# EAGLE design nixie_clock (EAGLE 9.5.1)
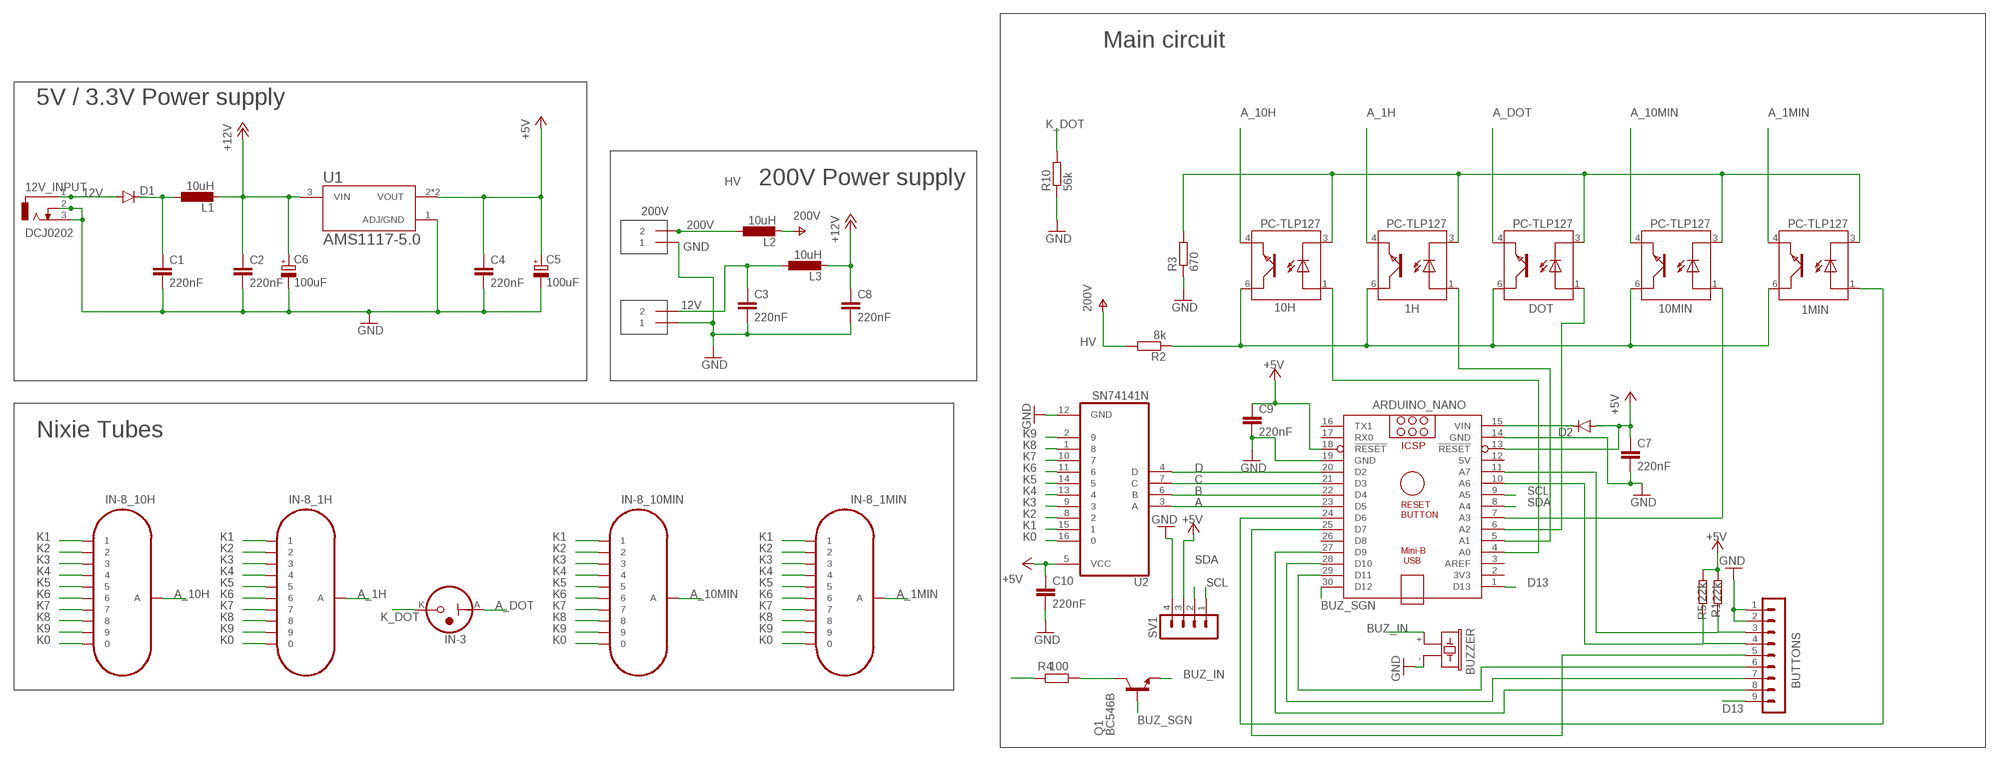
[diagram p0: schematic, sheet 1]

## Parts
1H  PC-TLP127  [MINIFLAT4]
1MIN  PC-TLP127  [MINIFLAT4]
10H  PC-TLP127  [MINIFLAT4]
10MIN  PC-TLP127  [MINIFLAT4]
12V  TERMINAL_2P  [KF301-2P]
12V_INPUT  DCJ0202  [DCJ0202]
200V  TERMINAL_2P  [KF301-2P]
ARDUINO_NANO  ARDUINO_NANO  [ARDUINO_NANO]
BUTTONS  MA09-1  [MA09-1]
BUZZER  F/CM12P  [F/CM12P]
C1  220nF  C2,5-3  [C2.5-3]
C2  220nF  C2,5-3  [C2.5-3]
C3  220nF  C2,5-3  [C2.5-3]
C4  220nF  C2,5-3  [C2.5-3]
C5  100uF  CPOL-EUE2,5-6E  [E2,5-6E]
C6  100uF  CPOL-EUE2,5-6E  [E2,5-6E]
C7  220nF  C2,5-3  [C2.5-3]
C8  220nF  C2,5-3  [C2.5-3]
C9  220nF  C2,5-3  [C2.5-3]
C10  220nF  C2,5-3  [C2.5-3]
D1  1N4148DO35-7  [DO35-7]
D2  1N4148DO35-7  [DO35-7]
DOT  PC-TLP127  [MINIFLAT4]
IN-3  IN-3  [IN-3]
IN-8_1H  IN-8  [IN-8]
IN-8_1MIN  IN-8  [IN-8]
IN-8_10H  IN-8  [IN-8]
IN-8_10MIN  IN-8  [IN-8]
L1  10uH  L-EU0204/7  [0204/7]
L2  10uH  L-EU0204/7  [0204/7]
L3  10uH  L-EU0204/7  [0204/7]
Q1  BC546B  [TO92-EBC]
R1  22k  R-EU_0204/7  [0204/7]
R2  8k  R-EU_0204/7  [0204/7]
R3  670  R-EU_0204/7  [0204/7]
R4  100  R-EU_0204/7  [0204/7]
R5  22k  R-EU_0204/7  [0204/7]
R10  56k  R-EU_0204/7  [0204/7]
SV1  MA04-1  [MA04-1]
U1  AMS1117-5.0  [SOT229P700X180-4N]
U2  SN74141N  [DIP762W46P254L2134H508Q16]

## Nets
12V [vastag]: 12V.2 12V_INPUT.1 C3.1 D1.A L3.1
200V [vastag]: 200V.2 L2.1
+5V [vastag]: ARDUINO_NANO.13(!RESET) ARDUINO_NANO.18(!RESET) C4.1 C5.+ C7.1 C9.1 C10.1 D2.A R1.2 R5.2 SV1.3 U1.2(VOUT) U1.4(VOUT) U2.5(VCC)
+12V [vastag]: C2.1 C6.+ C8.1 L1.2 L3.2 R4.1 U1.3(VIN)
A: ARDUINO_NANO.23(D5) U2.3(A)
A_1H [vastag]: 1H.4(TE) IN-8_1H.A
A_1MIN [vastag]: 1MIN.4(TE) IN-8_1MIN.A
A_10H [vastag]: 10H.4(TE) IN-8_10H.A
A_10MIN [vastag]: 10MIN.4(TE) IN-8_10MIN.A
A_DOT [vastag]: DOT.4(TE) IN-3.A
B: ARDUINO_NANO.22(D4) U2.6(B)
BUZ_IN: BUZZER.+ Q1.E
BUZ_SGN: ARDUINO_NANO.30(D12) Q1.B
C: ARDUINO_NANO.21(D3) U2.7(C)
D: ARDUINO_NANO.20(D2) U2.4(D)
D13: ARDUINO_NANO.1(D13) BUTTONS.9
GND [vastag]: 12V.1 12V_INPUT.2 12V_INPUT.3 200V.1 ARDUINO_NANO.14(GND) ARDUINO_NANO.19(GND) BUTTONS.1 BUTTONS.2 BUZZER.- C1.2 C2.2 C3.2 C4.2 C5.- C6.- C7.2 C8.2 C9.2 C10.2 R3.1 R10.1 SV1.4 U1.1(ADJ/GND) U2.12(GND)
HV [vastag]: L2.2 R2.2 ; supply symbol labelled 200V
K0 [vastag]: IN-8_1H.0 IN-8_1MIN.0 IN-8_10H.0 IN-8_10MIN.0 U2.16
K1 [vastag]: IN-8_1H.1 IN-8_1MIN.1 IN-8_10H.1 IN-8_10MIN.1 U2.15
K2 [vastag]: IN-8_1H.2 IN-8_1MIN.2 IN-8_10H.2 IN-8_10MIN.2 U2.8
K3 [vastag]: IN-8_1H.3 IN-8_1MIN.3 IN-8_10H.3 IN-8_10MIN.3 U2.9
K4 [vastag]: IN-8_1H.4 IN-8_1MIN.4 IN-8_10H.4 IN-8_10MIN.4 U2.13
K5 [vastag]: IN-8_1H.5 IN-8_1MIN.5 IN-8_10H.5 IN-8_10MIN.5 U2.14
K6 [vastag]: IN-8_1H.6 IN-8_1MIN.6 IN-8_10H.6 IN-8_10MIN.6 U2.11
K7 [vastag]: IN-8_1H.7 IN-8_1MIN.7 IN-8_10H.7 IN-8_10MIN.7 U2.10
K8 [vastag]: IN-8_1H.8 IN-8_1MIN.8 IN-8_10H.8 IN-8_10MIN.8 U2.1
K9 [vastag]: IN-8_1H.9 IN-8_1MIN.9 IN-8_10H.9 IN-8_10MIN.9 U2.2
K_DOT [vastag]: IN-3.K R10.2
N$1 [vastag]: ARDUINO_NANO.15(VIN) D2.C
N$2: C1.1 D1.C L1.1
N$3: 1MIN.1(A) ARDUINO_NANO.24(D6)
N$4: ARDUINO_NANO.25(D7) BUTTONS.5
N$5: 1H.6(TC) 1MIN.6(TC) 10H.6(TC) 10MIN.6(TC) DOT.6(TC) R2.1
N$7: Q1.C R4.2
N$9: ARDUINO_NANO.10(A6) BUTTONS.4 R5.1
N$10: ARDUINO_NANO.11(A7) BUTTONS.3 R1.1
N$15: 10H.1(A) ARDUINO_NANO.4(A0)
N$16: 1H.3(C) 1MIN.3(C) 10H.3(C) 10MIN.3(C) DOT.3(C) R3.2
N$18: ARDUINO_NANO.29(D11) BUTTONS.6
N$19: ARDUINO_NANO.28(D10) BUTTONS.7
N$20: ARDUINO_NANO.27(D9) BUTTONS.8
N$26: 1H.1(A) ARDUINO_NANO.5(A1)
N$27: ARDUINO_NANO.6(A2) DOT.1(A)
N$28: 10MIN.1(A) ARDUINO_NANO.7(A3)
SCL: ARDUINO_NANO.9(A5) SV1.1
SDA: ARDUINO_NANO.8(A4) SV1.2
Unconnected: ARDUINO_NANO.2(3V3) ARDUINO_NANO.3(AREF) ARDUINO_NANO.16(TX1) ARDUINO_NANO.17(RX0) ARDUINO_NANO.26(D8)

## Notes on the sheet
- Main circuit
- 5V / 3.3V Power supply
- 200V Power supply
- Nixie Tubes

## Power pins joined to a net without a drawn wire
5V: ARDUINO_NANO.12(5V)

## Library data of the parts
1H 1MIN 10H 10MIN DOT = we-opto:PC: Photocoupler / Photointerrupter TLP127 compatible with TLP187 and LTV-352T; DIGIKEY: TLP127FDKR-ND
12V 200V = KF301-2P-Terminal:TERMINAL_2P: Terminal Screw 2 Port 5mm Pitch
12V_INPUT = con-jack:DCJ0202: DC POWER JACK Source: DCJ0202.pdf; OC_FARNELL: unknown; OC_NEWARK: unknown
ARDUINO_NANO = arduinoNanoV30:ARDUINO_NANO: Arduino Nano V3.0 Overview: The Arduino Nano is a small, complete, and breadboard-friendly board based on the ATmega328 (Arduino Nano 3.x) or ATmega168 (Arduino Nano 2.x). It has more or less the same functionality of the Arduino Duemilanove, but in a different package. It lacks only a DC power jack, and works with a Mini-B USB cable instead of a standard one. The Nano was designed and is being produced by Gravitech. Specifications: Microcontroller Atmel ATmega168 or ATmega328 Operating Voltage (logic level) 5 V Input Voltage (recommended) 7-12 V Input Voltage (limits) 6-20 V Digital I/O Pins 14 (of which 6 provide PWM output) Analog Input Pins 8 DC Current per I/O Pin 40 mA Flash Memory 16 KB (ATmega168) or 32 KB (ATmega328) of which 2 KB used by bootloader SRAM 1 KB (ATmega168) or 2 KB (ATmega328) EEPROM 512 bytes (ATmega168) or 1 KB (ATmega328) Clock Speed 16 MHz Dimensions 0.73" x 1.70" Length 45 mm Width 18 mm Weigth 5 g Power: The Arduino Nano can be powered via the Mini-B USB connection, 6-20V unregulated external power supply (pin 30), or 5V regulated external power supply (pin 27). The power source is automatically selected to the highest voltage source. Memory: The ATmega168 has 16 KB of flash memory for storing code (of which 2 KB is used for the bootloader); the ATmega328 has 32 KB, (also with 2 KB used for the bootloader). The ATmega168 has 1 KB of SRAM and 512 bytes of EEPROM (which can be read and written with the EEPROM library); the ATmega328 has 2 KB of SRAM and 1 KB of EEPROM. Input and Output: Each of the 14 digital pins on the Nano can be used as an input or output, using pinMode(), digitalWrite(), and digitalRead() functions. They operate at 5 volts. Each pin can provide or receive a maximum of 40 mA and has an internal pull-up resistor (disconnected by default) of 20-50 kOhms. In addition, some pins have specialized functions. Visit Arduino - ArduinoBoardNano <https://www.arduino.cc/en/Main/ArduinoBoardNano>
BUTTONS = con-lstb:MA09-1: PIN HEADER; OC_FARNELL: unknown; OC_NEWARK: unknown
BUZZER = buzzer:F/CM12P: BUZZER Source: Buerklin; OC_FARNELL: unknown; OC_NEWARK: unknown
C1-C4 C7-C10 = capacitor-wima:C: CAPACITOR naming: grid - package width
C5 C6 = rcl:CPOL-EU: POLARIZED CAPACITOR, European symbol; SPICEPREFIX: C
D1 D2 = diode:1N4148: DIODE high speed (Philips)
IN-3 = nixies:IN-3: IN-3: nixie bulb
IN-8_1H IN-8_1MIN IN-8_10H IN-8_10MIN = nixies:IN-8: IN-8: medium numeric frontview nixie tube
L1-L3 = rcl:L-EU: INDUCTOR, European symbol; SPICEPREFIX: L
Q1 = transistor-npn:BC546*: NPN Transistor
R1-R5 R10 = rcl:R-EU_: RESISTOR, European symbol; SPICEPREFIX: R
SV1 = con-lstb:MA04-1: PIN HEADER; OC_FARNELL: unknown; OC_NEWARK: unknown
U1 = AMS1117-5.0:AMS1117-5.0: Sot223/Pkg 1-Amp 5-Volt Low Drop Out Voltage Regulatator; AVAILABILITY: Unavailable; DESCRIPTION: Sot223/Pkg 1-Amp 5-Volt Low Drop Out Voltage Regulatator; MF: Advanced Monolithic Systems; MP: AMS1117-5.0; PACKAGE: None; PRICE: None
U2 = SN74141N:SN74141N: BCD to DECIMAL Decoder/Driver; AVAILABILITY: Unavailable; MF: Texas Instruments; MP: SN74141N; PACKAGE: None; PRICE: None

## Net classes
0 default: width 0.152 mm, drill 0.2 mm, clearance 0.205 mm
1 vastag: width 0.254 mm, drill 0.2 mm, clearance 0.3 mm to class 0, clearance 0.3 mm

## Board
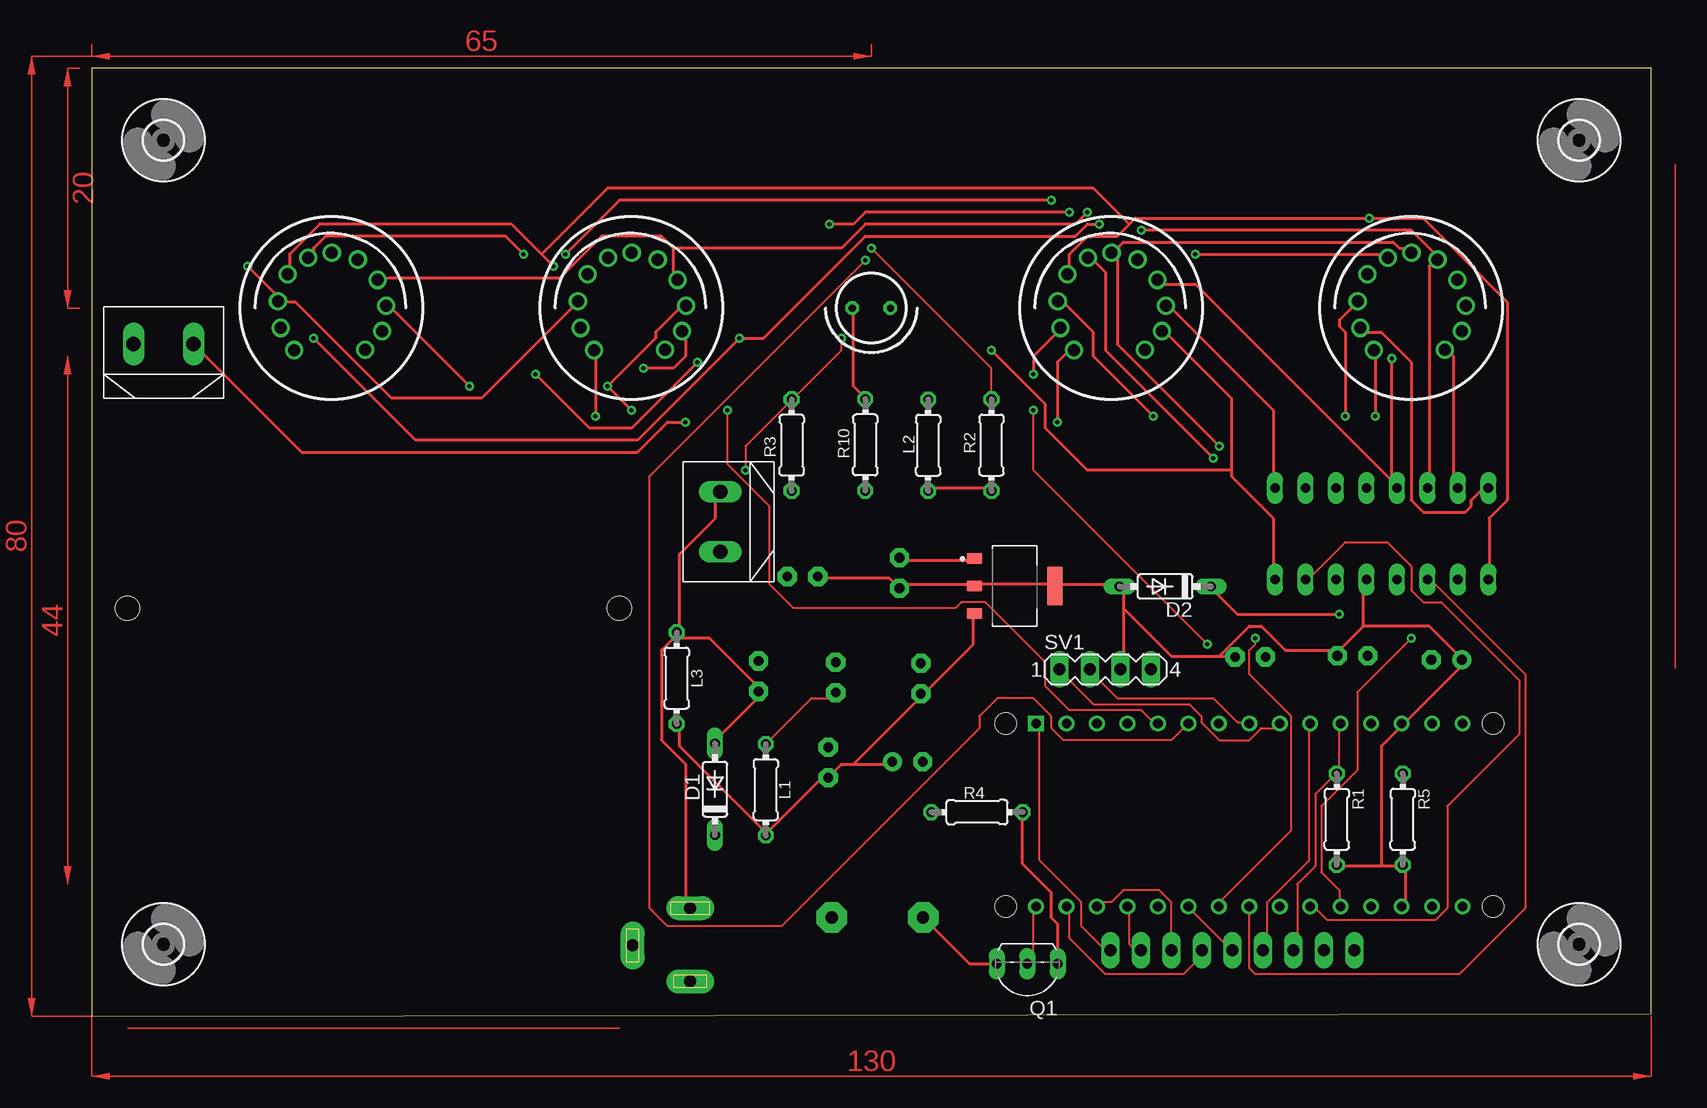
[diagram p1: board, top side]
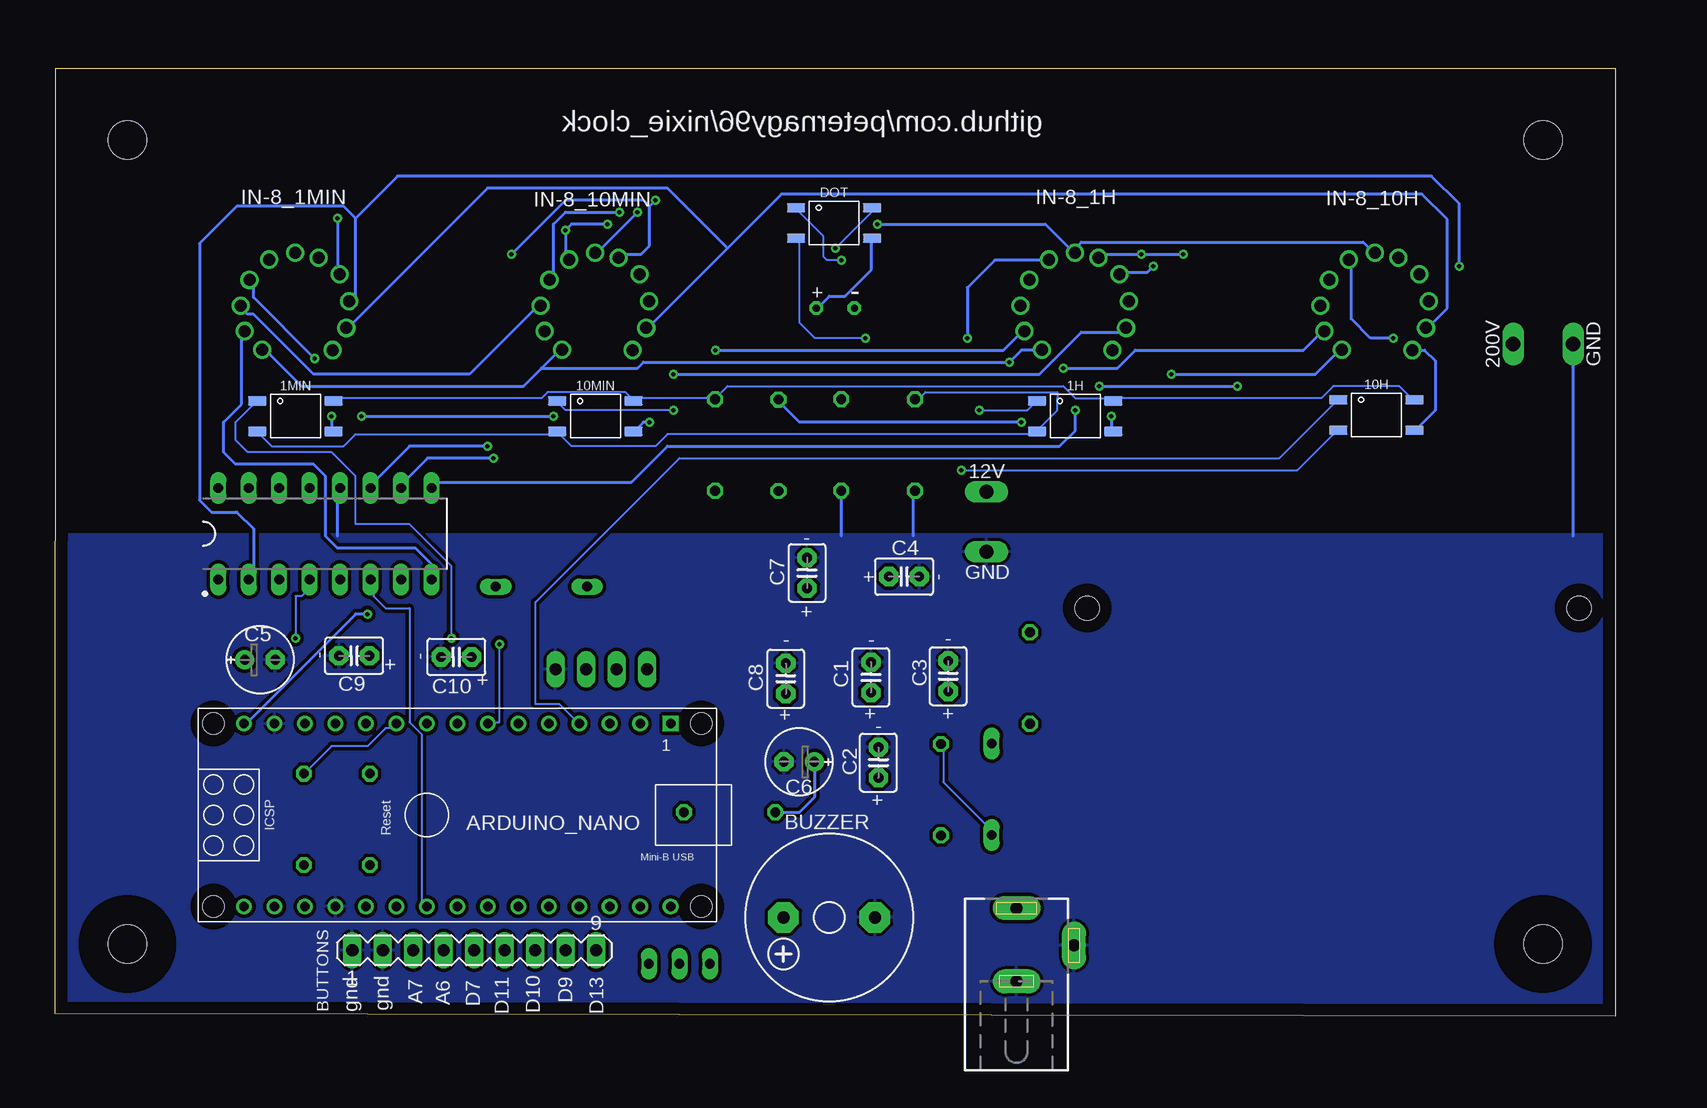
[diagram p2: board, bottom side, seen from below]

Size 130.03 x 79 mm. Coordinates in mm from the lower left corner, seen from the top.
Outline: 0,0 130.03,0.2 130,79 0,79 0,0
Copper layers (1*16): Top 0.035mm / dielectric 1.5mm / Bottom 0.035mm
Design rules "default": minimum track width 6mil, minimum drill 0.35mm, track to track 6mil, track to pad 6mil, pad to pad 6mil, via to via 6mil, smd to smd 6mil, copper to edge 40mil, drill to drill 6mil, minimum pad ring 10mil, minimum via ring 8mil, stop-mask expansion 4mil, vias tented up to drill 0mil, thermal gap 10mil
Holes 2 mm at 3,34 44,34

### Footprints (pad centres in the part's own frame; a part is rotated, then mirrored left to right if it is on the bottom)
MINIFLAT4 = smd 1.524 x 0.762: 1 -3.175,1.27; 3 -3.175,-1.27; 4 3.175,-1.27; 6 3.175,1.27
KF301-2P = drill 1.2 pad 1.778 long: 1 -2.5,0; 2 2.5,0
DCJ0202 = drill 1 pad 2 long: 1 0,3.1; 2 4.8,0; 3 0,-3
ARDUINO_NANO = drill 0.8 square: 1 -20.32,-7.62 | drill 0.8: 2 -17.78,-7.62; 3 -15.24,-7.62; 4 -12.7,-7.62; 5 -10.16,-7.62; 6 -7.62,-7.62; 7 -5.08,-7.62; 8 -2.54,-7.62; 9 0,-7.62; 10 2.54,-7.62; 11 5.08,-7.62; 12 7.62,-7.62; 13 10.16,-7.62; 14 12.7,-7.62; 15 15.24,-7.62; 16 15.24,7.62; 17 12.7,7.62; 18 10.16,7.62; 19 7.62,7.62; 20 5.08,7.62; 21 2.54,7.62; 22 0,7.62; 23 -2.54,7.62; 24 -5.08,7.62; 25 -7.62,7.62; 26 -10.16,7.62; 27 -12.7,7.62; 28 -15.24,7.62; 29 -17.78,7.62; 30 -20.32,7.62 | hole 1.778: -22.86,-7.62; -22.86,7.62; 17.78,7.62; 17.78,-7.62
MA09-1 = drill 1.016 long: 1 -10.16,0; 2 -7.62,0; 3 -5.08,0; 4 -2.54,0; 5 0,0; 6 2.54,0; 7 5.08,0; 8 7.62,0; 9 10.16,0
F/CM12P = drill 1.016 pad 2.54 octagon: + 3.81,0; - -3.81,0
C2.5-3 = drill 0.813 pad 1.6 octagon: 1 -1.27,0; 2 1.27,0
E2,5-6E = drill 0.813 pad 1.575: + -1.27,0 | drill 0.813 pad 1.575 octagon: - 1.27,0
DO35-7 = drill 0.813 long: A 3.81,0; C -3.81,0
IN-3 = drill 0.6 octagon: A -1.587,0; K 1.587,0
IN-8 = drill 1: 0 -4.244,-1.655; 1 2.792,-3.483; 2 4.222,-1.907; 3 4.556,0.189; 4 3.837,2.348; 5 2.203,4.052; 6 0.034,4.603; 7 -1.928,4.186; 8 -3.666,2.83; 9 -4.461,0.584; A -3.101,-3.49
0204/7 = drill 0.813 octagon: 1 -3.81,0; 2 3.81,0
TO92-EBC = drill 0.813 long: B 0,-1.27; C -2.54,-1.27; E 2.54,-1.27
MA04-1 = drill 1.016 long: 1 -3.81,0; 2 -1.27,0; 3 1.27,0; 4 3.81,0
SOT229P700X180-4N = smd 0.93 x 1.31: 1 -2.29,-3.345; 2 0,-3.345; 3 2.29,-3.345 | smd 3.24 x 1.31: 4 0,3.345
DIP762W46P254L2134H508Q16 = drill 0.813 long: 1 -3.81,8.89; 2 -3.81,6.35; 3 -3.81,3.81; 4 -3.81,1.27; 5 -3.81,-1.27; 6 -3.81,-3.81; 7 -3.81,-6.35; 8 -3.81,-8.89; 9 3.81,-8.89; 10 3.81,-6.35; 11 3.81,-3.81; 12 3.81,-1.27; 13 3.81,1.27; 14 3.81,3.81; 15 3.81,6.35; 16 3.81,8.89
3,2 = hole 3.2: 0,0

### Placement (x,y rotation side)
1H  45,50 0 bottom
1MIN  110,50 0 bottom
10H  19.9,50.1 0 bottom
10MIN  85,50 0 bottom
12V  52.4,41.2 90 top
12V_INPUT  49.9,5.9 0 bottom
200V  6,56 0 top
ARDUINO_NANO  99.05,16.76 180 bottom
BUTTONS  95.1,5.49 0 bottom
BUZZER  65.51,8.22 180 bottom
C1  62.03,28.23 90 bottom
C2  61.41,21.13 90 bottom
C3  55.59,28.33 90 bottom
C4  59.27,36.63 0 bottom
C5  112.95,29.69 0 bottom
C6  68.02,21.19 180 bottom
C7  67.35,36.93 90 bottom
C8  69.13,28.13 90 bottom
C9  105.11,30.03 180 bottom
C10  96.59,29.93 180 bottom
D1  51.97,18.91 90 top
D2  89.5,35.8 180 top
DOT  65.1,66.1 0 bottom
IN-3  65,59 180 top
IN-8_1H  45,59 0 top
IN-8_1MIN  110,59 0 top
IN-8_10H  20,59 0 top
IN-8_10MIN  85,59 0 top
L1  56.2,18.87 270 top
L2  69.74,47.57 270 top
L3  48.78,28.17 270 top
Q1  78,3.1 180 top
R1  103.8,16.4 270 top
R2  75.02,47.59 270 top
R3  58.36,47.59 90 top
R4  73.81,17 0 top
R5  109.3,16.4 270 top
R10  64.5,47.6 90 top
SV1  84.5,28.9 0 top
U1  76.96,35.83 270 top
U2  107.55,40.2 90 bottom
U$1  [3,2]  6,73 0 top
U$2  [3,2]  124,73 0 top
U$3  [3,2]  124,6 0 top
U$4  [3,2]  6,6 0 top

### Tracks (layer width: path | path; a pad name or v marks a point on that pad's centre or on a via)
12V
  Top 0.254: D1.A 52,23 56,27 C3.1 55.5,27.5 51.5,31.5 49,31.5 L3.1 | 12V.2 52,43.5 52,41.5 49,38.5 49,32 L3.1 | 12V_INPUT.1 49.5,9 49.5,21 47.5,23 47.5,30.5 48.5,31.5 L3.1
200V  (via drill 0.35)
  Top 0.254: v49.5,49.5 48,49.5 45.5,47 17.5,47 200V.2
  Bottom 0.254: v49.5,49.5 68,49.5 69.5,51 L2.1
+5V
  Top 0.254: 106,32.5 106,36 U2.5 | 106,32.5 104,30.5 C9.1 103.5,30.5 99.5,30.5 97.5,32.5 96.5,32.5 94,30 | ARDUINO_NANO.18 109.5,9.5 109.5,12.5 R5.2 109,12.5 107.5,12.5 | 107.5,12.5 104,12.5 R1.2 | 107.5,12.5 107.5,22.5 109,24 ARDUINO_NANO.13 109.5,24.5 114.5,29.5 C5.+ 114,30 111.5,32.5 106,32.5 | C4.1 61,36.5 66.5,36.5 67,36 C7.1 67.5,36 73.5,36 U1.2 74,36 80,36 U1.4 80.5,36 85.5,36 D2.A 86,35.5 86,34 | 86,34 86,29 SV1.3 | 94,30 90,30 86,34 | 94,30 95,30 C10.1
+12V
  Top 0.254: U1.3 73.5,33.5 73.5,31 69.5,27 C8.1 69,26.5 63.5,21 | L3.2 49,24 49,22.5 56,15.5 L1.2 56.5,15.5 61,20 C2.1 61.5,20 62.5,21 63.5,21 | 63.5,21 66.5,21 C6.+
  Bottom 0.254: R4.1 68,17 66.7,18.3 66.7,21.14 C6.+
A
  Top 0.152: ARDUINO_NANO.23 96.5,9 96.5,4 97,3.5 114,3.5 119.5,9 119.5,28.5 111.5,36.5 U2.3
A_1H  (via drill 0.35)
  Top 0.254: v42,50 42,55.5 IN-8_1H.A
  Bottom 0.254: v42,50 42,49 1H.4
A_1MIN  (via drill 0.35)
  Top 0.254: v107,50 107,55.5 IN-8_1MIN.A
  Bottom 0.254: v107,50 107,49 1MIN.4
A_10H
  Bottom 0.254: 10H.4 16.5,49 15,50.5 15,54.6 15.9,55.5 16.5,55.5 IN-8_10H.A
A_10MIN  (via drill 0.35)
  Top 0.254: v80.5,49.5 80.5,54.5 81.5,55.5 IN-8_10MIN.A
  Bottom 0.254: v80.5,49.5 81,49.5 81.5,49 10MIN.4
A_DOT
  Bottom 0.254: DOT.4 62,64.5 62,62.2 64.2,60 65.5,60 66.5,59 IN-3.A
B
  Bottom 0.152: ARDUINO_NANO.22 99.5,9.5 99.5,23.5 100.5,24.5 100.5,34 102.5,34 103.5,35 103.5,36 U2.6
BUZ_IN
  Top 0.254: BUZZER.+ 73.17,4.37 Q1.E
BUZ_SGN
  Top 0.152: ARDUINO_NANO.30 78.5,9 78.5,5 78,4.5 Q1.B
C
  Top 0.152: ARDUINO_NANO.21 102,9 103,8 112,8 113,9 113,17.5 119,23.5 119,28 112.5,34.5 111,34.5 110,35.5 110,37.5 108,39.5 104.5,39.5 101.5,36.5 U2.7
D  (via drill 0.35)
  Top 0.152: v110,31.5 105.5,27 105.5,20.5 102.5,17.5 102.5,12 104,10.5 104,9.5 ARDUINO_NANO.20
  Bottom 0.152: v110,31.5 110,35 109.5,35 108.5,36 U2.4
D13
  Top 0.152: ARDUINO_NANO.1 79,24 79,13 82.5,9.5 82.5,7.5 84.5,5.5 BUTTONS.9
GND
  Top 0.254: U1.1 73.5,38 67.5,38 C7.2
  Bottom 0.254: 58.5,40 58.5,43.5 R3.1 | 64.5,40 R10.1 | 106.5,40 106.5,44 U2.12 | 3.5,40 200V.1
  pour Bottom: -4,-8 131,-8 131,40.2 -4,40.2
HV
  Top 0.254: L2.2 70,44 75,44 R2.2
K0  (via drill 0.35)
  Top 0.254: U2.16 116,44 115,43 115,42.5 114.5,42 111,42 110,43 110,54.5 107.5,57 106,57 IN-8_1MIN.0 | v78.5,53.5 78.5,55 80.5,57 IN-8_10MIN.0
  Bottom 0.254: 74,64 80.5,57.5 IN-8_10MIN.0 | 74,64 69.5,68.5 16.1,68.5 14,66.4 14,59 15.5,57.5 IN-8_10H.0 | v78.5,53.5 48,53.5 44.5,57 41,57 IN-8_1H.0 | 74,64 79,69 94,69 105.5,57.5 IN-8_1MIN.0
K1  (via drill 0.35)
  Top 0.254: v37,53.5 41.5,49 45,49 v50.5,54.5 | U2.15 113.5,44.5 113.5,55 113,55.5 IN-8_1MIN.1
  Bottom 0.254: v37,53.5 25,53.5 23,55.5 IN-8_10H.1 | IN-8_1H.1 48,55.5 49.5,55.5 v50.5,54.5 81,54.5 81.5,54 89.5,54 | 89.5,54 91,52.5 109.5,52.5 112.5,55.5 IN-8_1MIN.1 | 89.5,54 88,55.5 IN-8_10MIN.1
K2  (via drill 0.35)
  Top 0.254: v46,54 48.5,54 49.5,55 49.5,57 IN-8_1H.2 | 95,45.5 95,51.5 89.5,57 IN-8_10MIN.2 | 95,45.5 95,45 98.5,41.5 98.5,36.5 U2.8 | v75,55.5 79.5,51 79.5,49 83,45.5 95,45.5
  Bottom 0.254: v46,54 41.5,54 40,55.5 26,55.5 24.5,57 IN-8_10H.2 | IN-8_1MIN.2 114.5,57 114.5,51 116,49.5 116,47 115,46 108.5,46 107.5,45 107.5,40 106.5,39 100,39 98.5,37.5 98.5,36.5 U2.8 | v75,55.5 51,55.5 49.5,57 IN-8_1H.2
K3  (via drill 0.35)
  Top 0.254: v31.5,52.5 25,59 IN-8_10H.3 | IN-8_1H.3 49.5,59.5 47,57 47,56.5 v43,52.5 v45,50.5 | U2.9 98.5,44.5 98.5,50.5 90,59 IN-8_10MIN.3
  Bottom 0.254: v43,52.5 v31.5,52.5 | IN-8_1MIN.3 114.5,59 114,58.5 113.5,58.5 108.5,53.5 95.5,53.5 90,59 IN-8_10MIN.3 | v45,50.5 45,48.8 46.3,47.5 79,47.5 82,44.5 98.5,44.5 U2.9
K4  (via drill 0.35)
  Top 0.254: 48.5,64 47.5,65 42.5,65 39,61.5 24,61.5 IN-8_10H.4 | 48.5,64 48.5,61.5 IN-8_1H.4 | 108.4,44.6 92,61 89,61 IN-8_10MIN.4 | 108.4,44.6 108.5,44.5 U2.13 | 108.4,44.6 v108.4,54.8 | 48.5,64 62.5,64 64.5,66 82,66 v83,67
  Bottom 0.254: v108.4,54.8 113.5,59.9 113.5,61 IN-8_1MIN.4 | v83,67 87.5,67 88.5,66 88.5,61.5 IN-8_10MIN.4
K5  (via drill 0.35)
  Top 0.254: U2.14 111.5,44.5 111.5,62.5 112,63 IN-8_1MIN.5 112,63.5 110,65.5 v87.5,65.5 | v18.5,56.5 27,48 45.5,48 v54,56.5 56,56.5 64.5,65 82,65 83,66 v84,66
  Bottom 0.254: IN-8_10MIN.5 87.5,63.5 v87.5,65.5 87,66 v84,66 | v18.5,56.5 20.4,56.5 22,58.1 22,63 IN-8_10H.5 | v54,56.5 54,60.7 51.7,63 47.5,63 IN-8_1H.5
K6  (via drill 0.35)
  Top 0.254: v94,47.5 85.5,56 85.5,63.5 IN-8_10MIN.6 85.5,64 86,64.5 108.5,64.5 109,64 110,64 IN-8_1MIN.6 | v61.5,66 63.5,66 64.5,67 v81.5,67
  Bottom 0.254: IN-8_10H.6 20.5,64 21,64.5 44.5,64.5 45,64 IN-8_1H.6 45.5,64 47.5,66 v61.5,66 | v94,47.5 100.5,47.5 103.5,44.5 U2.11 | v81.5,67 84.5,64 85,64 IN-8_10MIN.6
K7  (via drill 0.35)
  Top 0.254: v36,63.5 34.5,65 19.5,65 18.5,64 18.5,63.5 IN-8_10H.7 | v93.5,46.5 84.5,55.5 84.5,62 83.5,63 IN-8_10MIN.7 | v92,63.5 108,63.5 IN-8_1MIN.7 | v39.5,63.5 44,68 v80,68
  Bottom 0.254: v36,63.5 v39.5,63.5 43,63.5 IN-8_1H.7 | v93.5,46.5 99,46.5 101,44.5 U2.10 | v92,63.5 87.5,68 81,68 80.5,67.5 | 80.5,67.5 80.5,64.2 81.2,63.5 83,63.5 IN-8_10MIN.7 | 80.5,67.5 v80,68
K8  (via drill 0.35)
  Top 0.254: v38.5,62.5 37.5,63.5 | 37.5,63.5 35,66 19,66 16.5,63.5 16.5,62 IN-8_10H.8 | 86.5,66 85.5,65 83,65 81.5,63.5 81.5,62 IN-8_10MIN.8 | 86.5,66 87,66.5 v106.5,66.5 111,66.5 118,59.5 118,43 116.5,41.5 116.5,36.5 U2.1 | 37.5,63.5 43,69 83.5,69 86.5,66
  Bottom 0.254: v38.5,62.5 39,62 41,62 IN-8_1H.8 | v106.5,66.5 106.5,62 IN-8_1MIN.8
K9  (via drill 0.35)
  Top 0.254: IN-8_1H.9 40.5,59.5 32.5,51.5 25,51.5 17,59.5 16,59.5 IN-8_10H.9 15.5,60 v13,62.5 | v88.5,50 83.5,55 83.5,57 81,59.5 IN-8_10MIN.9 | v104.5,50 104.5,57 104,57.5 104,58 105.5,59.5 IN-8_1MIN.9
  Bottom 0.254: 105,66.5 106,67.5 114.9,67.5 118,64.4 118,43 117,42 115,42 114.9,42 113.5,40.6 113.5,36.5 U2.2 | 105,66.5 105,60 105.5,60 IN-8_1MIN.9 | v104.5,50 v88.5,50 | v13,62.5 13,67.7 15.3,70 101.5,70 105,66.5
K_DOT
  Top 0.254: IN-3.K 63.5,59 63.5,52.5 64.5,51.5 R10.2
N$1  (via drill 0.35)
  Top 0.254: v104,33.5 95.5,33.5 93.5,35.5 D2.C
  Bottom 0.254: v104,33.5 105,33.5 114,24.5 ARDUINO_NANO.15
N$2
  Top 0.152: C1.1 62,26.5 60,26.5 56.5,23 L1.1
  Bottom 0.152: D1.C 52,15.5 56,19.5 56,22.5 L1.1
N$3  (via drill 0.35)
  Top 0.152: v97,31.5 97,31 96.5,30.5 96.5,28.5 100,25 100,15.5 94,9.5 ARDUINO_NANO.24
  Bottom 0.152: v97,31.5 97,37.5 100.5,41 105,41 105,45 107,47 114,47 115,48 115,49.5 113.5,51 1MIN.1
N$4
  Top 0.152: ARDUINO_NANO.25 91.5,9 95,5.5 BUTTONS.5
N$5  (via drill 0.35)
  Top 0.152: v65,64 75,54 75,51.5 R2.1
  Bottom 0.152: 10H.6 17,51.5 18,52.5 23.5,52.5 24.5,51.5 41.5,51.5 1H.6 42,51.5 45,51.5 46,52.5 74,52.5 75,51.5 R2.1 75.5,51.5 81.5,51.5 10MIN.6 82,51.5 82.5,52 89,52 89.5,51.5 106.5,51.5 1MIN.6 | v65,64 62,67 DOT.6
N$7
  Top 0.254: Q1.C 80.54,7.66 80,8.2 80,10.3 77.6,12.7 77.6,16.98 R4.2
N$9
  Top 0.152: ARDUINO_NANO.10 101.5,24 101.5,13 98,9.5 98,5.5 BUTTONS.4
  Bottom 0.152: R5.1 109,20.5 107,22.5 104,22.5 102.5,24 102,24 ARDUINO_NANO.10
N$10
  Top 0.152: ARDUINO_NANO.11 104,24 104,20.5 R1.1 103.5,20 102,18.5 102,12.5 100.5,11 100.5,5.5 BUTTONS.3
N$15
  Bottom 0.152: 10H.1 23.5,51 28,46.5 78,46.5 90,34.5 90,26 88,26 86.5,24.5 ARDUINO_NANO.4
N$16  (via drill 0.35)
  Top 0.152: v54.5,45.5 54.5,47.5 58,51 R3.2 58.5,51.5 62.5,55.5 v62.5,56.5
  Bottom 0.152: 1MIN.3 113,48.5 112,47.5 106,47.5 105,48.5 88.5,48.5 10MIN.3 88,48.5 87,47.5 80,47.5 79,48.5 48.5,48.5 1H.3 48,49 46.5,50.5 46.5,51.3 46.5,51.5 | 46.5,51.5 46.5,52 57.5,52 58,51.5 R3.2 | v54.5,45.5 26.5,45.5 23.5,48.5 10H.3 | v62.5,56.5 66.7,56.5 68,57.8 68,64.5 DOT.3 | 46.5,51.5
N$18
  Top 0.152: ARDUINO_NANO.29 81.5,9 81.5,6.5 84.5,3.5 91,3.5 92.5,5 BUTTONS.6
N$19
  Top 0.152: ARDUINO_NANO.28 84,9.5 85,9.5 86,10.5 89,10.5 90,9.5 90,5.5 BUTTONS.7
N$20
  Top 0.152: ARDUINO_NANO.27 86.5,9 86.5,6 87,5.5 BUTTONS.8
N$26  (via drill 0.35)
  Top 0.152: v53,50.5 53,46 56.5,42.5 56.5,36 58.5,34 72,34 72.5,34.5 74.5,34.5 79.5,29.5 79.5,27.5 81.5,25.5 87.5,25.5 88.5,24.5 ARDUINO_NANO.5
  Bottom 0.152: v53,50.5 49,50.5 48.5,51 1H.1
N$27  (via drill 0.35)
  Top 0.152: v64.5,63 46.5,45 46.5,9 48,7.5 57.5,7.5 74,24 74,25 75.5,26.5 78.5,26.5 80,25 80,24 81,23 90,23 91,24 ARDUINO_NANO.6
  Bottom 0.152: v64.5,63 65.5,63 65.7,63 66,63.3 66,65 68,67 DOT.1
N$28  (via drill 0.35)
  Top 0.152: v78.5,50.5 78.5,45.5 v93,31
  Bottom 0.152: v78.5,50.5 87.5,50.5 88,51 10MIN.1 | v93,31 93,24.5 93.5,24.5 ARDUINO_NANO.7
SCL
  Top 0.152: ARDUINO_NANO.9 99,24 97.5,24 96.5,23 94,23 92.5,24.5 92.5,25 91.5,26 83.5,26 81,28.5 SV1.1
SDA
  Top 0.152: ARDUINO_NANO.8 96.5,24.5 95.5,24.5 93.5,26.5 85.5,26.5 83.5,28.5 SV1.2
(copper drawn outside any net)
  shapes: Top area x9

### Text on the board
bNames: github.com/peternagy96/nixie_clock | - | + | GND | 200V | 12V | - | + | GND | - | + | - | - | - | - | + | - | + | + | + | + | - | + | D13 | D9 | D10 | D11 | D7 | A6 | A7 | gnd | gnd